# EAGLE schematic mmu6100cp (EAGLE 6.6.0)

## Sheet 1 of 3
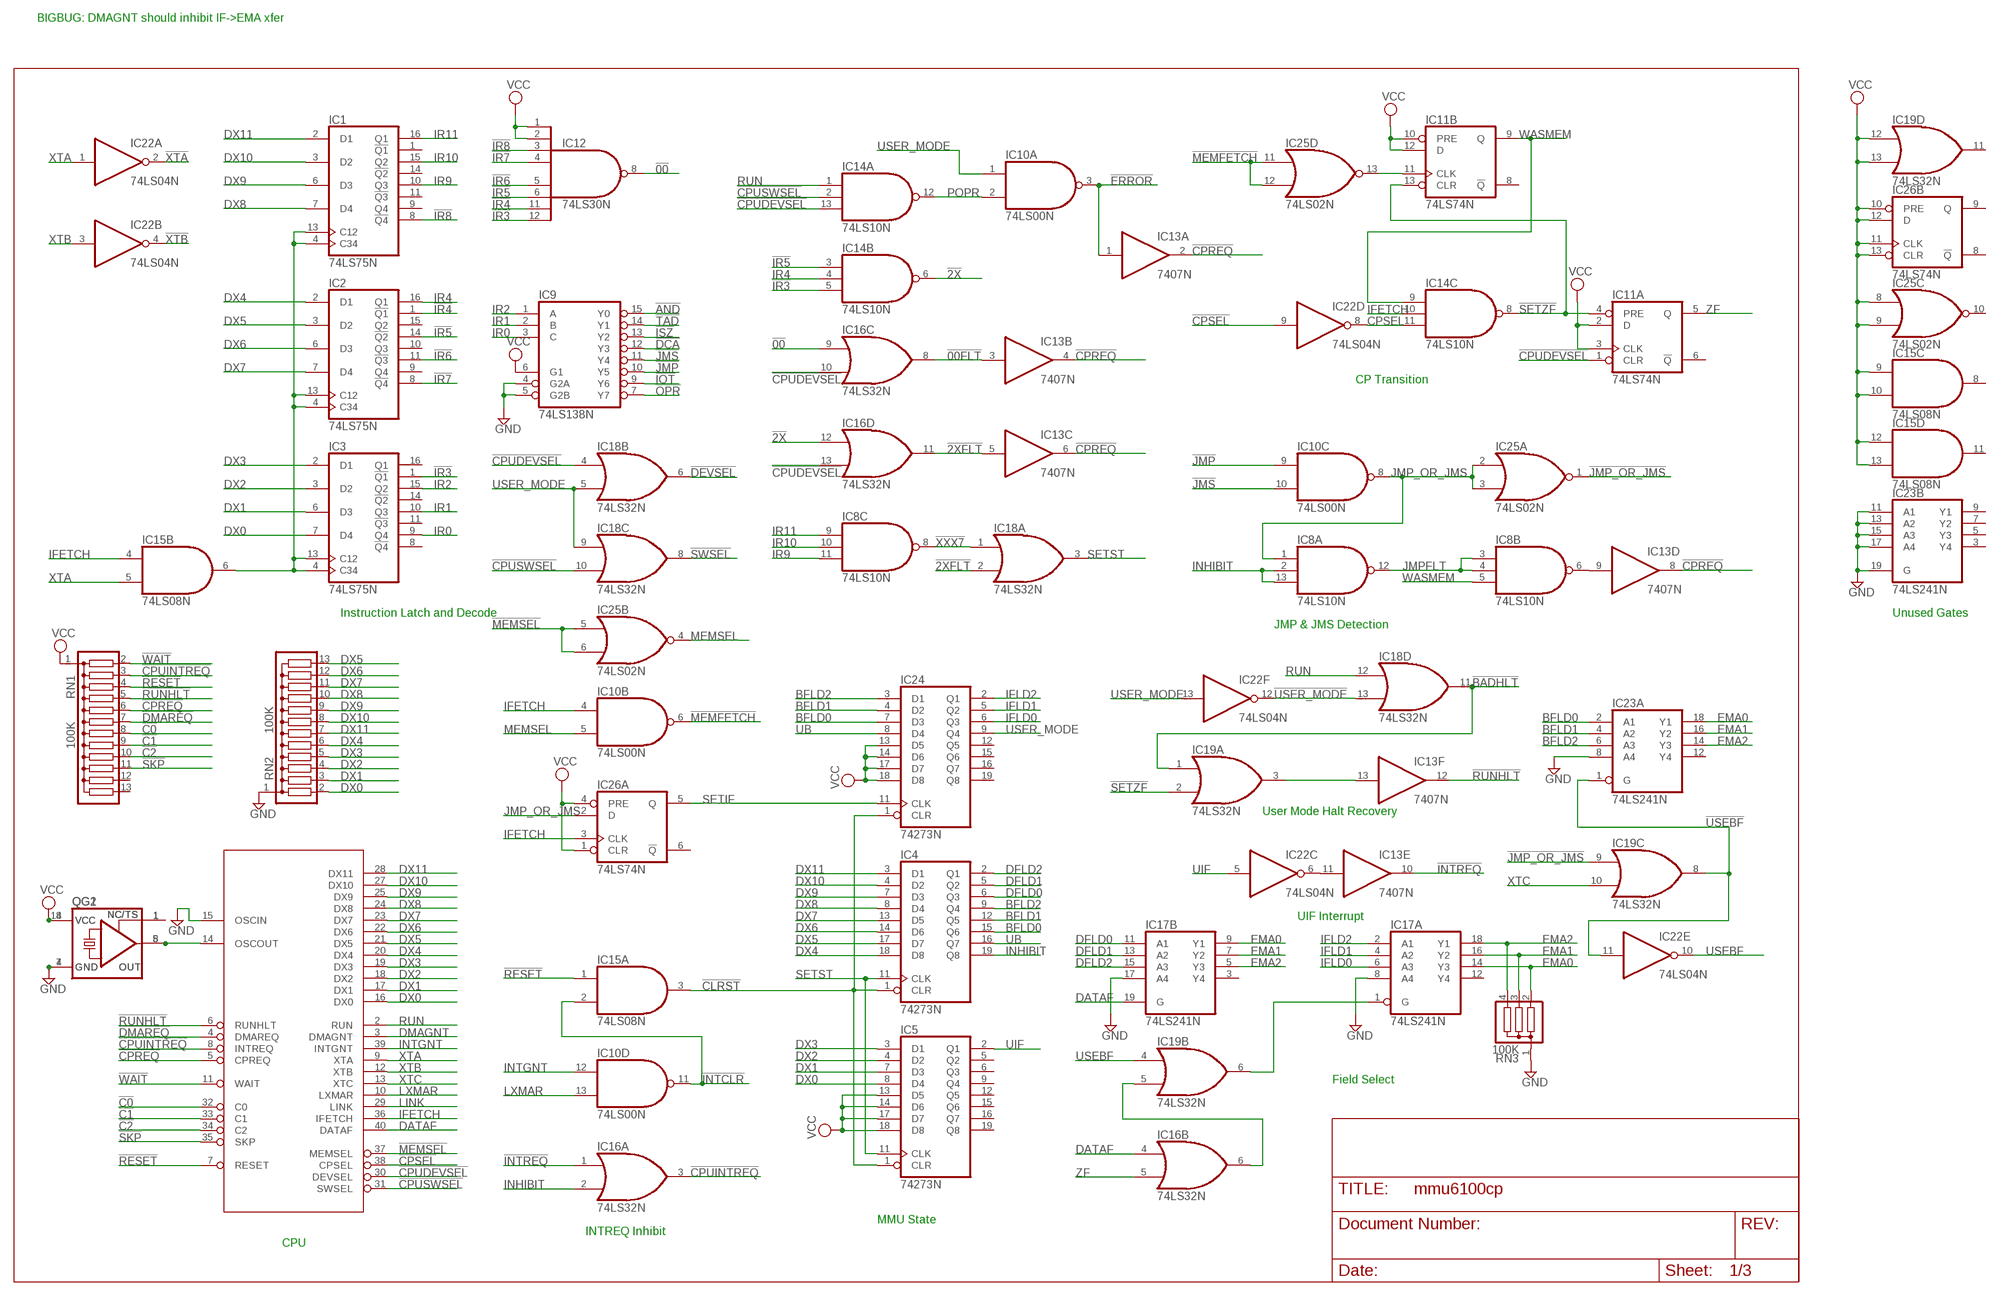
[diagram p0: schematic, sheet 1]

### Parts
CPU  IM6100  [DIL40]
IC1  74LS75N  [DIL16]
IC2  74LS75N  [DIL16]
IC3  74LS75N  [DIL16]
IC4  74273N  [DIL20]
IC5  74273N  [DIL20]
IC8  74LS10N  [DIL14]
IC9  74LS138N  [DIL16]
IC10  74LS00N  [DIL14]
IC11  74LS74N  [DIL14]
IC12  74LS30N  [DIL14]
IC13  7407N  [DIL14]
IC14  74LS10N  [DIL14]
IC15  74LS08N  [DIL14]
IC16  74LS32N  [DIL14]
IC17  74LS241N  [DIL20]
IC18  74LS32N  [DIL14]
IC19  74LS32N  [DIL14]
IC22  74LS04N  [DIL14]
IC23  74LS241N  [DIL20]
IC24  74273N  [DIL20]
IC25  74LS02N  [DIL14]
IC26  74LS74N  [DIL14]
QG1  XO-8  [DIL08S]
QG2  XO-14  [DIL14S]
RN1  100K  G12R  [SIL13]
RN2  100K  G12R  [SIL13]
RN3  100K  G03R  [SIL4]

### Nets
!00: IC12.8(O) IC16.9(C:I0)
!00FLT: IC13.3(B:I) IC16.8(C:O)
!2X: IC14.6(B:O) IC16.12(D:I0)
!2XFLT: IC13.5(C:I) IC16.11(D:O) IC18.2(A:I1)
!AND: IC9.15(Y0) ; also sheet 3
!BADHLT: IC18.11(D:O) IC19.1(A:I0)
!C0: CPU.32(C0) RN1.8 ; also sheet 3
!C1: CPU.33(C1) RN1.9 ; also sheet 3
!C2: CPU.34(C2) RN1.10 ; also sheet 3
!CLRST: IC4.1(CLR) IC5.1(CLR) IC15.3(A:O) IC24.1(CLR)
!CPREQ: CPU.5(CPREQ) IC13.2(A:O) IC13.4(B:O) IC13.6(C:O) IC13.8(D:O) RN1.6 ; also sheet 3
!CPSEL: CPU.38(CPSEL) IC22.9(D:I)
!CPUDEVSEL: CPU.30(DEVSEL) IC11.1(A:CLR) IC14.13(A:I2) IC16.10(C:I1) IC16.13(D:I1) IC18.4(B:I0)
!CPUINTREQ: CPU.8(INTREQ) IC16.3(A:O) RN1.3
!CPUSWSEL: CPU.31(SWSEL) IC14.2(A:I1) IC18.10(C:I1)
!DCA: IC9.12(Y3) ; also sheet 3
!DEVSEL: IC18.6(B:O) ; also sheet 3
!DMAREQ: CPU.4(DMAREQ) RN1.7 ; also sheet 3
!ERROR: IC10.3(A:O) IC13.1(A:I)
!INTCLR: IC10.11(D:O) IC15.2(A:I1)
!INTREQ: IC13.10(E:O) IC16.1(A:I0) ; also sheet 3
!IOT: IC9.9(Y6) ; also sheet 3
!IR3: IC3.1(!Q1) IC12.12(I7) IC14.5(B:I2)
!IR4: IC2.1(!Q1) IC12.11(I6)
!IR5: IC2.14(!Q2) IC12.6(I5) IC14.3(B:I0)
!IR6: IC2.11(!Q3) IC12.5(I4)
!IR7: IC2.8(!Q4) IC12.4(I3)
!IR8: IC1.8(!Q4) IC12.3(I2)
!ISZ: IC9.13(Y2) ; also sheet 3
!JMP: IC9.10(Y5) IC10.9(C:I0)
!JMP_OR_JMS: IC19.9(C:I0) IC25.1(A:O)
!JMS: IC9.11(Y4) IC10.10(C:I1)
!MEMFETCH: IC10.6(B:O) IC25.11(D:I0) IC25.12(D:I1)
!MEMSEL: CPU.37(MEMSEL) IC25.5(B:I0) IC25.6(B:I1) ; also sheet 3
!OPR: IC9.7(Y7) ; also sheet 3
!RESET: CPU.7(RESET) IC15.1(A:I0) RN1.4 ; also sheet 3
!RUNHLT: CPU.6(RUNHLT) IC13.12(F:O) RN1.5 ; also sheet 3
!SETZF: IC11.4(A:PRE) IC11.13(B:CLR) IC14.8(C:O) IC19.2(A:I1)
!SKP: CPU.35(SKP) RN1.11 ; also sheet 3
!SWSEL: IC18.8(C:O) ; also sheet 3
!TAD: IC9.14(Y1) ; also sheet 3
!USEBF: IC19.8(C:O) IC22.11(E:I) IC23.1(A:G)
!USER_MODE: IC18.13(D:I1) IC22.12(F:O)
!WAIT: CPU.11(WAIT) RN1.2 ; also sheet 3
!XTA: IC22.2(A:O)
!XTB: IC22.4(B:O)
!XXX7: IC8.8(C:O) IC18.1(A:I0)
BFLD0: IC4.15(Q6) IC23.2(A:A1) IC24.7(D3)
BFLD1: IC4.12(Q5) IC23.4(A:A2) IC24.4(D2)
BFLD2: IC4.9(Q4) IC23.6(A:A3) IC24.3(D1)
CPSEL: IC14.11(C:I2) IC22.8(D:O) ; also sheet 3
DATAF: CPU.40(DATAF) IC16.4(B:I0) IC17.19(B:G)
DFLD0: IC4.6(Q3) IC17.11(B:A1)
DFLD1: IC4.5(Q2) IC17.13(B:A2)
DFLD2: IC4.2(Q1) IC17.15(B:A3)
DMAGNT: CPU.3(DMAGNT) ; also sheet 3
DX0: CPU.16(DX0) IC3.7(D4) IC5.8(D4) RN2.2 ; also sheet 3
DX1: CPU.17(DX1) IC3.6(D3) IC5.7(D3) RN2.3 ; also sheet 3
DX2: CPU.18(DX2) IC3.3(D2) IC5.4(D2) RN2.4 ; also sheet 3
DX3: CPU.19(DX3) IC3.2(D1) IC5.3(D1) RN2.5 ; also sheet 3
DX4: CPU.20(DX4) IC2.2(D1) IC4.18(D8) RN2.6 ; also sheet 3
DX5: CPU.21(DX5) IC2.3(D2) IC4.17(D7) RN2.13 ; also sheet 3
DX6: CPU.22(DX6) IC2.6(D3) IC4.14(D6) RN2.12 ; also sheet 3
DX7: CPU.23(DX7) IC2.7(D4) IC4.13(D5) RN2.11 ; also sheet 3
DX8: CPU.24(DX8) IC1.7(D4) IC4.8(D4) RN2.10 ; also sheet 3
DX9: CPU.25(DX9) IC1.6(D3) IC4.7(D3) RN2.9 ; also sheet 3
DX10: CPU.27(DX10) IC1.3(D2) IC4.4(D2) RN2.8 ; also sheet 3
DX11: CPU.28(DX11) IC1.2(D1) IC4.3(D1) RN2.7 ; also sheet 3
EMA0: IC17.9(B:Y1) IC17.14(A:Y3) IC23.18(A:Y1) RN3.2 ; also sheet 3
EMA1: IC17.7(B:Y2) IC17.16(A:Y2) IC23.16(A:Y2) RN3.3 ; also sheet 3
EMA2: IC17.5(B:Y3) IC17.18(A:Y1) IC23.14(A:Y3) RN3.4 ; also sheet 3
GND: CPU.15(OSCIN) IC9.4(G2A) IC9.5(G2B) IC17.8(A:A4) IC17.17(B:A4) IC23.8(A:A4) IC23.11(B:A1) IC23.13(B:A2) IC23.15(B:A3) IC23.17(B:A4) IC23.19(B:G) QG1.4(GND) QG2.7(GND) RN2.1 RN3.1 ; also sheet 3
IFETCH: CPU.36(IFETCH) IC10.4(B:I0) IC14.10(C:I1) IC15.4(B:I0) IC26.3(A:CLK)
IFLD0: IC17.6(A:A3) IC24.6(Q3)
IFLD1: IC17.4(A:A2) IC24.5(Q2)
IFLD2: IC17.2(A:A1) IC24.2(Q1)
INHIBIT: IC4.19(Q8) IC8.2(A:I1) IC8.13(A:I2) IC16.2(A:I1)
INTGNT: CPU.39(INTGNT) IC10.12(D:I0) ; also sheet 3
IR0: IC3.9(Q4) IC9.3(C)
IR1: IC3.10(Q3) IC9.2(B)
IR2: IC3.15(Q2) IC9.1(A)
IR4: IC2.16(Q1) IC14.4(B:I1)
IR9: IC1.10(Q3) IC8.11(C:I2)
IR10: IC1.15(Q2) IC8.10(C:I1)
IR11: IC1.16(Q1) IC8.9(C:I0)
JMP_OR_JMS: IC8.1(A:I0) IC10.8(C:O) IC25.2(A:I0) IC25.3(A:I1) IC26.2(A:D)
JMPFLT: IC8.3(B:I0) IC8.4(B:I1) IC8.12(A:O)
LINK: CPU.29(LINK) ; also sheet 3
LXMAR: CPU.10(LXMAR) IC10.13(D:I1) ; also sheet 3
MEMSEL: IC10.5(B:I1) IC25.4(B:O) ; also sheet 3
N$2: QG1.1(TS) QG2.1(TS)
N$3: IC1.4(C34) IC1.13(C12) IC2.4(C34) IC2.13(C12) IC3.4(C34) IC3.13(C12) IC15.6(B:O)
N$5: IC13.11(E:I) IC22.6(C:O)
N$6: IC11.11(B:CLK) IC25.13(D:O)
N$7: IC13.13(F:I) IC19.3(A:O)
N$8: IC16.6(B:O) IC19.5(B:I1)
N$10: IC17.1(A:G) IC19.6(B:O)
N$15: IC8.6(B:O) IC13.9(D:I)
OSCOUT: CPU.14(OSCOUT) QG1.5(OUT) QG2.8(OUT)
POPR: IC10.2(A:I1) IC14.12(A:O)
RUN: CPU.2(RUN) IC14.1(A:I0) IC18.12(D:I0)
SETIF: IC24.11(CLK) IC26.5(A:Q)
SETST: IC4.11(CLK) IC5.11(CLK) IC18.3(A:O)
UB: IC4.16(Q7) IC24.8(D4)
UIF: IC5.2(Q1) IC22.5(C:I)
USEBF: IC19.4(B:I0) IC22.10(E:O)
USER_MODE: IC10.1(A:I0) IC18.5(B:I1) IC18.9(C:I0) IC22.13(F:I) IC24.9(Q4)
VCC: IC5.13(D5) IC5.14(D6) IC5.17(D7) IC5.18(D8) IC9.6(G1) IC11.2(A:D) IC11.3(A:CLK) IC11.10(B:PRE) IC11.12(B:D) IC12.1(I0) IC12.2(I1) IC15.9(C:I0) IC15.10(C:I1) IC15.12(D:I0) IC15.13(D:I1) IC19.12(D:I0) IC19.13(D:I1) IC24.13(D5) IC24.14(D6) IC24.17(D7) IC24.18(D8) IC25.8(C:I0) IC25.9(C:I1) IC26.1(A:CLR) IC26.4(A:PRE) IC26.10(B:PRE) IC26.11(B:CLK) IC26.12(B:D) IC26.13(B:CLR) QG1.8(VCC) QG2.14(VCC) RN1.1 ; also sheet 3
WASMEM: IC8.5(B:I2) IC11.9(B:Q) IC14.9(C:I0)
XTA: CPU.9(XTA) IC15.5(B:I1) IC22.1(A:I) ; also sheet 3
XTB: CPU.12(XTB) IC22.3(B:I) ; also sheet 3
XTC: CPU.13(XTC) IC19.10(C:I1) ; also sheet 3
ZF: IC11.5(A:Q) IC16.5(B:I1)
Unconnected: IC1.1(!Q1) IC1.9(Q4) IC1.11(!Q3) IC1.14(!Q2) IC2.9(Q4) IC2.10(Q3) IC2.15(Q2) IC3.8(!Q4) IC3.11(!Q3) IC3.14(!Q2) IC3.16(Q1) IC5.5(Q2) IC5.6(Q3) IC5.9(Q4) IC5.12(Q5) IC5.15(Q6) IC5.16(Q7) IC5.19(Q8) IC11.6(A:!Q) IC11.8(B:!Q) IC15.8(C:O) IC15.11(D:O) IC17.3(B:Y4) IC17.12(A:Y4) IC19.11(D:O) IC23.3(B:Y4) IC23.5(B:Y3) IC23.7(B:Y2) IC23.9(B:Y1) IC23.12(A:Y4) IC24.12(Q5) IC24.15(Q6) IC24.16(Q7) IC24.19(Q8) IC25.10(C:O) IC26.6(A:!Q) IC26.8(B:!Q) IC26.9(B:Q) RN1.12 RN1.13

### Notes on the sheet
- BIGBUG: DMAGNT should inhibit IF->EMA xfer
- CP Transition
- Instruction Latch and Decode | Unused Gates
- JMP & JMS Detection
- User Mode Halt Recovery
- UIF Interrupt
- Field Select
- MMU State
- INTREQ Inhibit
- CPU

## Sheet 2 of 3
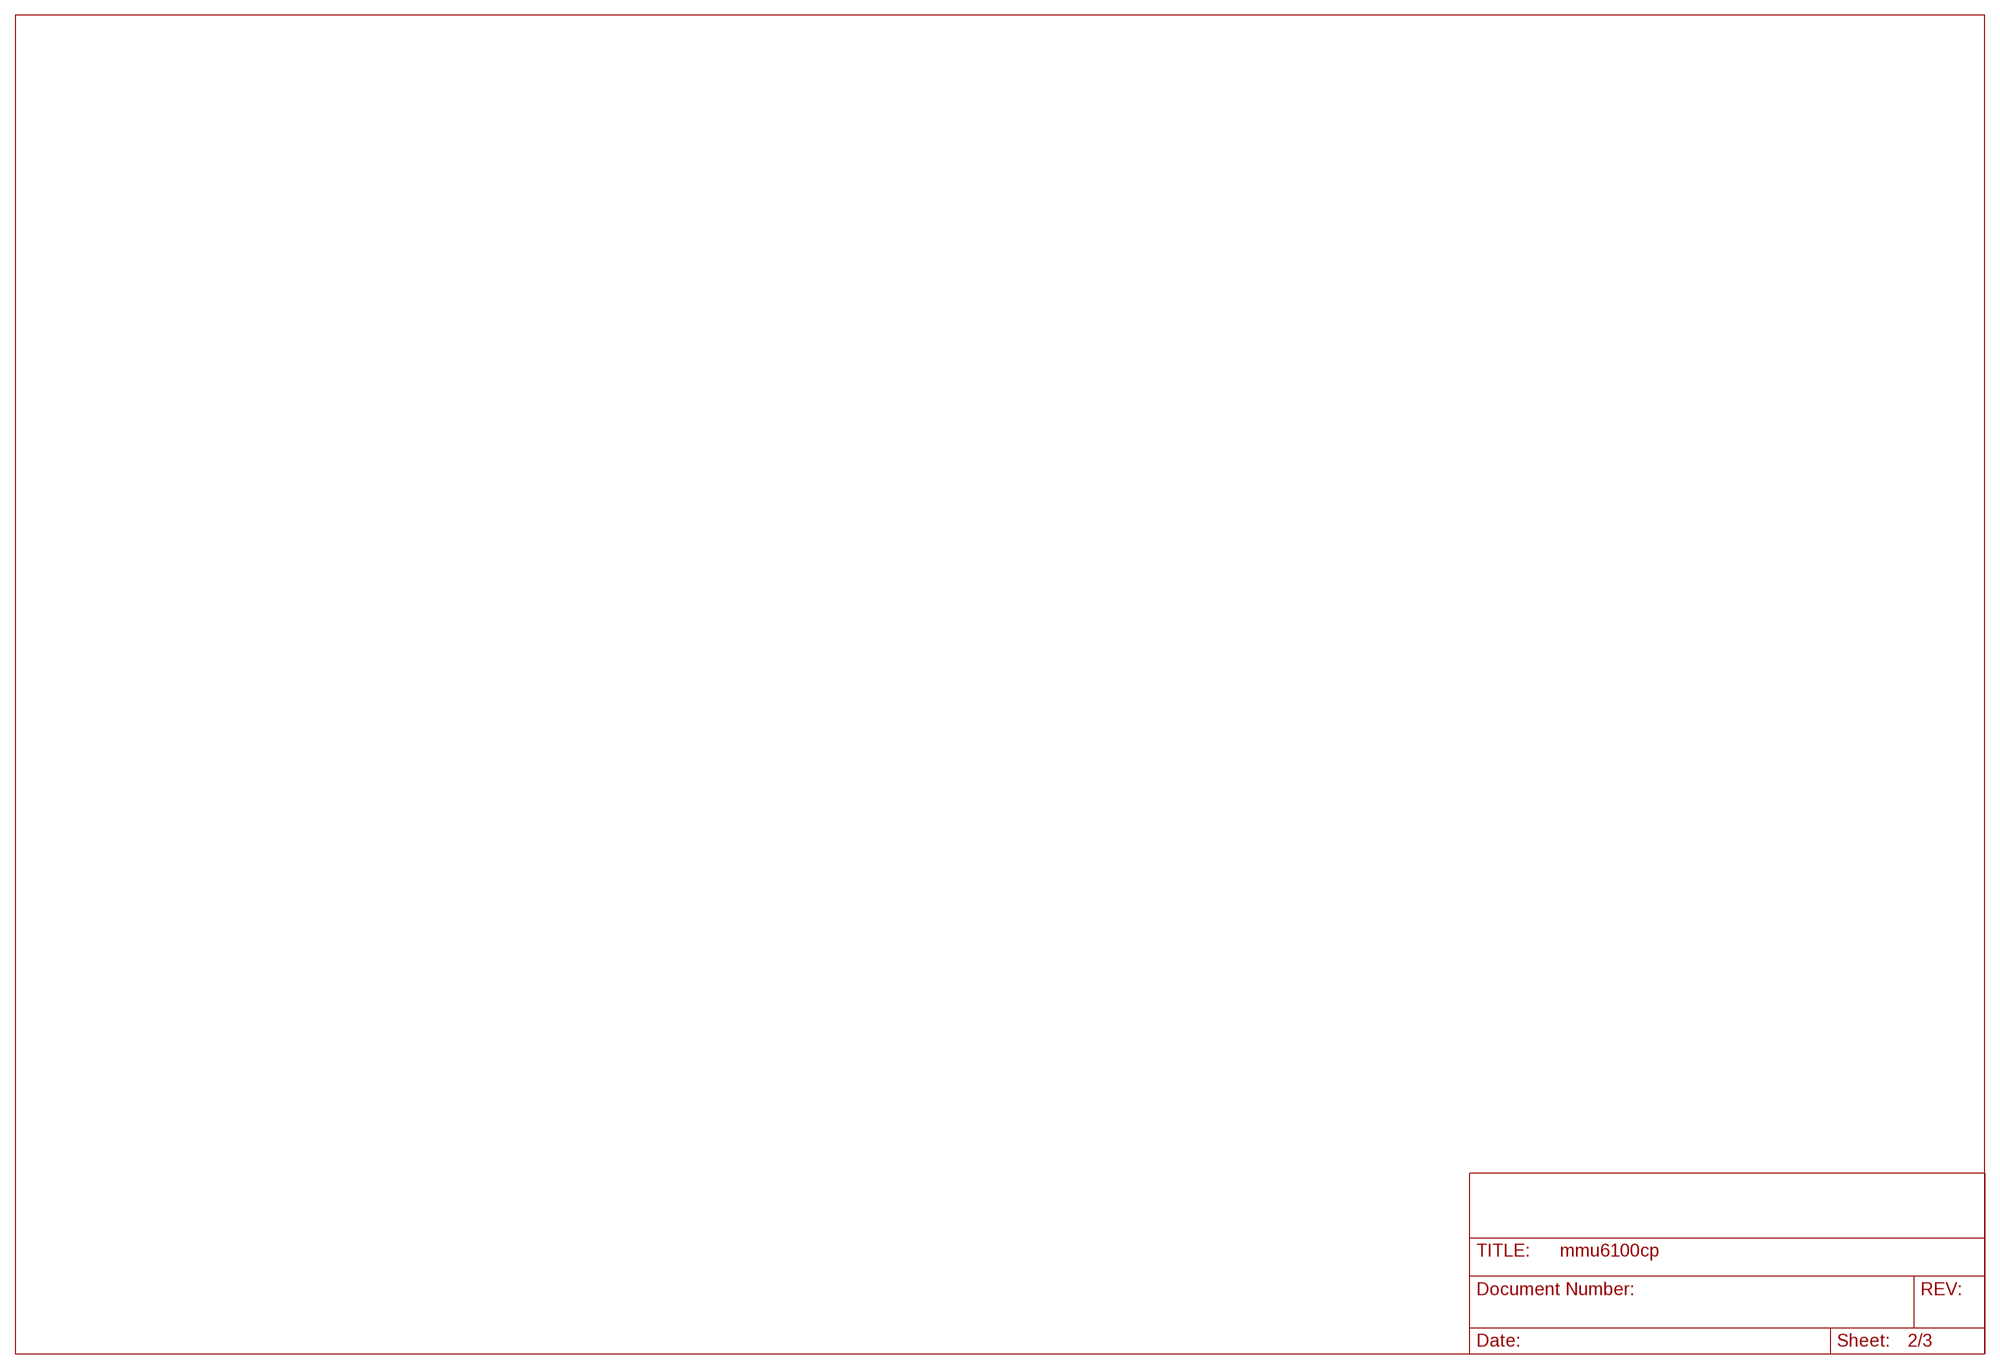
[diagram p1: schematic, sheet 2]

## Sheet 3 of 3
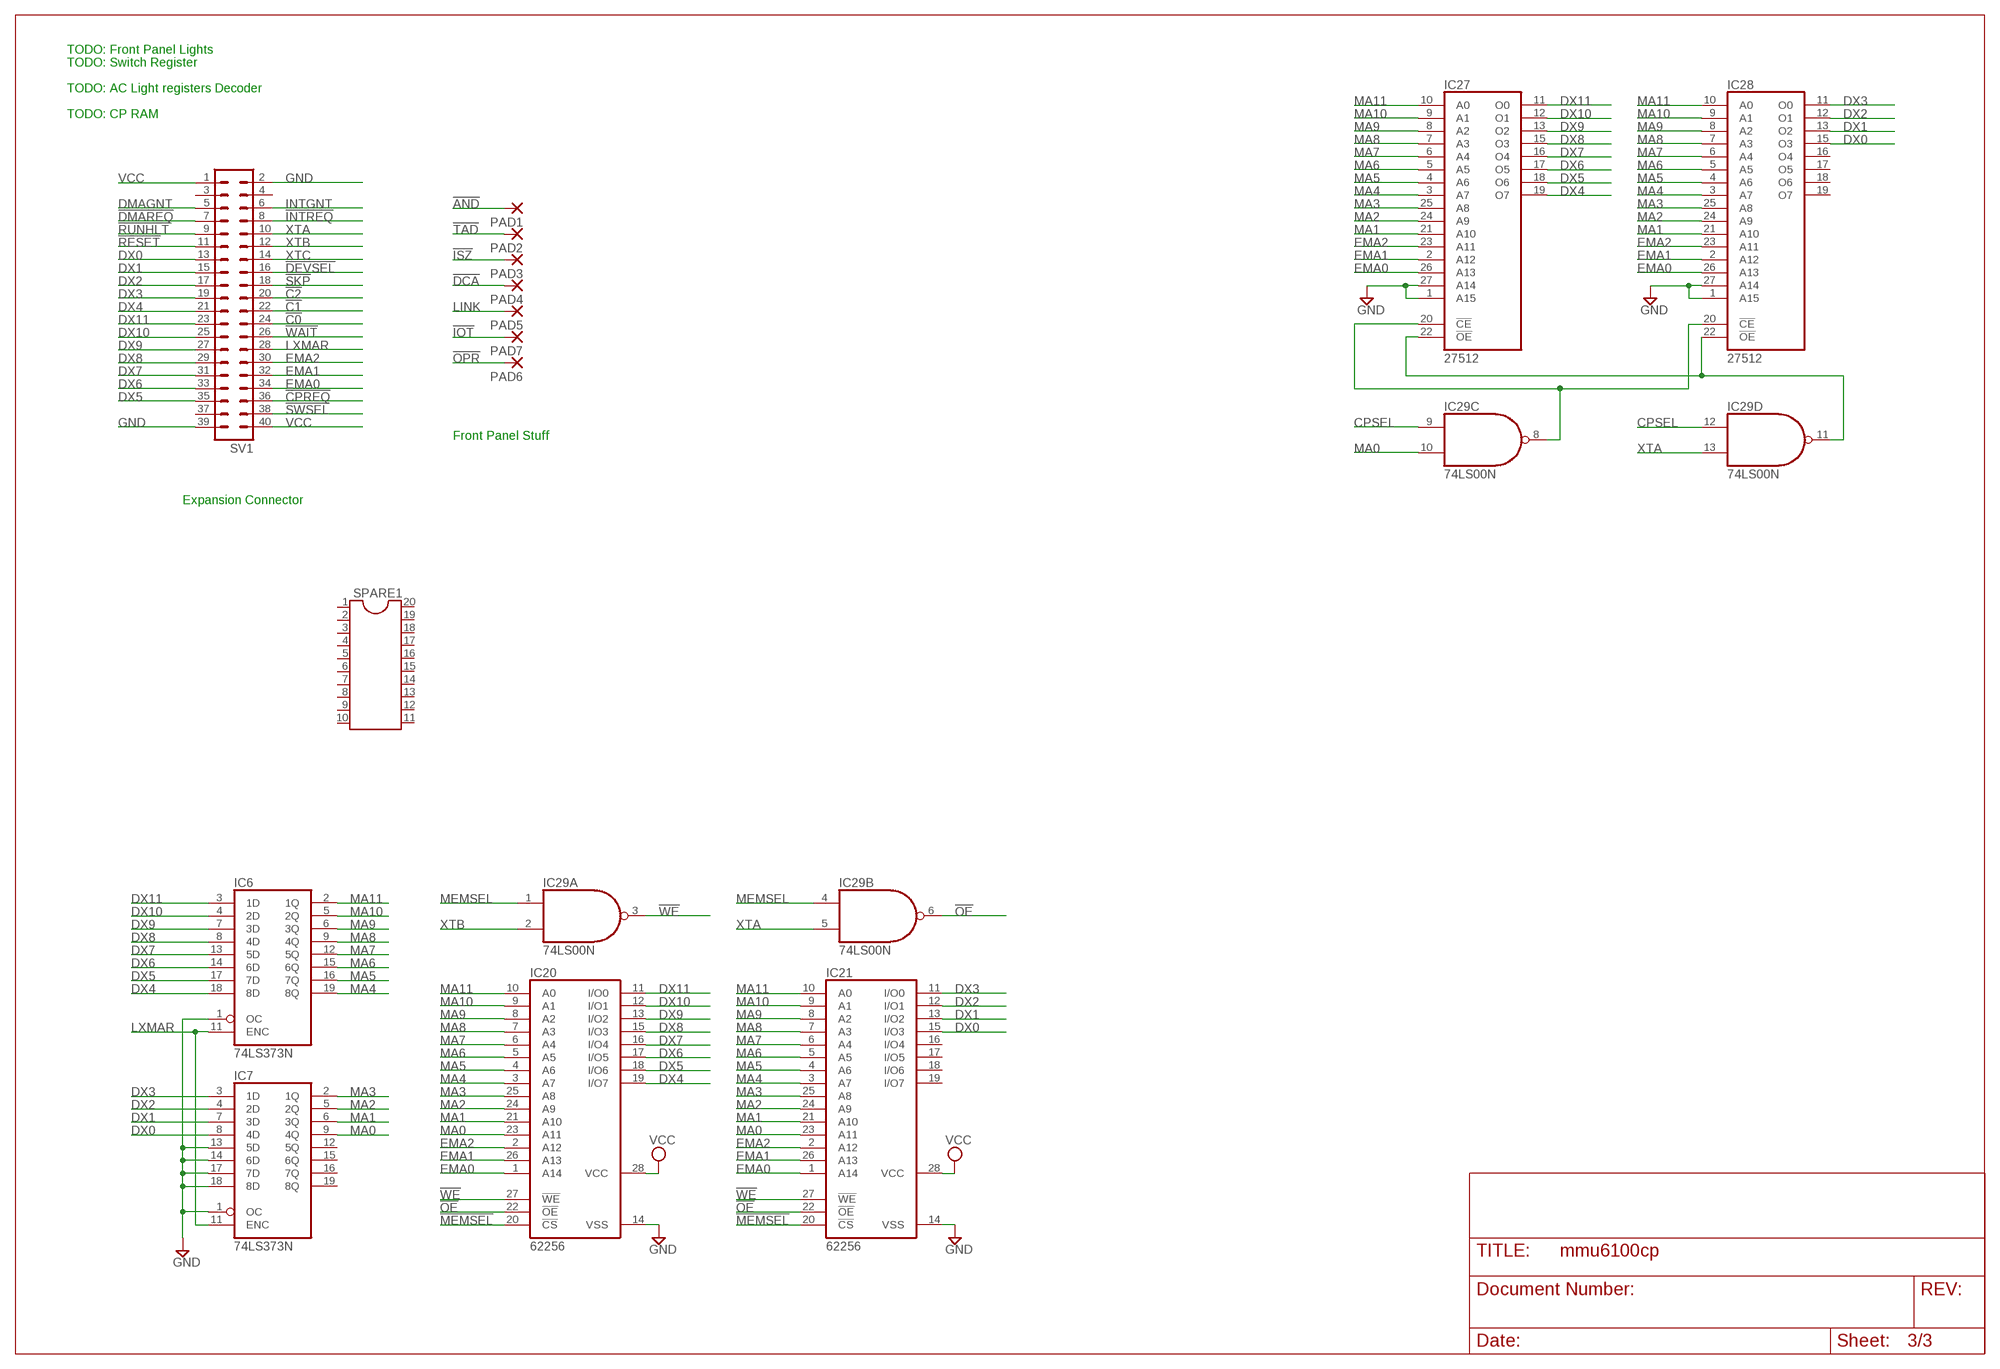
[diagram p2: schematic, sheet 3]

### Parts
IC6  74LS373N  [DIL20]
IC7  74LS373N  [DIL20]
IC20  62256  62256P  [DIL28-6]
IC21  62256  62256P  [DIL28-6]
IC27  27512  [DIL28]
IC28  27512  [DIL28]
IC29  74LS00N  [DIL14]
PAD1  2,15/1,0  [2,15/1,0]
PAD2  2,15/1,0  [2,15/1,0]
PAD3  2,15/1,0  [2,15/1,0]
PAD4  2,15/1,0  [2,15/1,0]
PAD5  2,15/1,0  [2,15/1,0]
PAD6  2,15/1,0  [2,15/1,0]
PAD7  2,15/1,0  [2,15/1,0]
SPARE1  DIL20  [DIL20]
SV1  MA20-2  [MA20-2]

### Nets
!AND: PAD1.1(P) ; also sheet 1
!C0: SV1.24 ; also sheet 1
!C1: SV1.22 ; also sheet 1
!C2: SV1.20 ; also sheet 1
!CPREQ: SV1.36 ; also sheet 1
!DCA: PAD4.1(P) ; also sheet 1
!DEVSEL: SV1.16 ; also sheet 1
!DMAREQ: SV1.7 ; also sheet 1
!INTREQ: SV1.8 ; also sheet 1
!IOT: PAD7.1(P) ; also sheet 1
!ISZ: PAD3.1(P) ; also sheet 1
!MEMSEL: IC20.20(!CS) IC21.20(!CS) ; also sheet 1
!OE: IC20.22(!OE) IC21.22(!OE) IC29.6(B:O)
!OPR: PAD6.1(P) ; also sheet 1
!RESET: SV1.11 ; also sheet 1
!RUNHLT: SV1.9 ; also sheet 1
!SKP: SV1.18 ; also sheet 1
!SWSEL: SV1.38 ; also sheet 1
!TAD: PAD2.1(P) ; also sheet 1
!WAIT: SV1.26 ; also sheet 1
!WE: IC20.27(!WE) IC21.27(!WE) IC29.3(A:O)
CPSEL: IC29.9(C:I0) IC29.12(D:I0) ; also sheet 1
DMAGNT: SV1.5 ; also sheet 1
DX0: IC7.8(4D) IC21.15(I/O3) IC28.15(O3) SV1.13 ; also sheet 1
DX1: IC7.7(3D) IC21.13(I/O2) IC28.13(O2) SV1.15 ; also sheet 1
DX2: IC7.4(2D) IC21.12(I/O1) IC28.12(O1) SV1.17 ; also sheet 1
DX3: IC7.3(1D) IC21.11(I/O0) IC28.11(O0) SV1.19 ; also sheet 1
DX4: IC6.18(8D) IC20.19(I/O7) IC27.19(O7) SV1.21 ; also sheet 1
DX5: IC6.17(7D) IC20.18(I/O6) IC27.18(O6) SV1.35 ; also sheet 1
DX6: IC6.14(6D) IC20.17(I/O5) IC27.17(O5) SV1.33 ; also sheet 1
DX7: IC6.13(5D) IC20.16(I/O4) IC27.16(O4) SV1.31 ; also sheet 1
DX8: IC6.8(4D) IC20.15(I/O3) IC27.15(O3) SV1.29 ; also sheet 1
DX9: IC6.7(3D) IC20.13(I/O2) IC27.13(O2) SV1.27 ; also sheet 1
DX10: IC6.4(2D) IC20.12(I/O1) IC27.12(O1) SV1.25 ; also sheet 1
DX11: IC6.3(1D) IC20.11(I/O0) IC27.11(O0) SV1.23 ; also sheet 1
EMA0: IC20.1(A14) IC21.1(A14) IC27.26(A13) IC28.26(A13) SV1.34 ; also sheet 1
EMA1: IC20.26(A13) IC21.26(A13) IC27.2(A12) IC28.2(A12) SV1.32 ; also sheet 1
EMA2: IC20.2(A12) IC21.2(A12) IC27.23(A11) IC28.23(A11) SV1.30 ; also sheet 1
GND: IC6.1(OC) IC7.1(OC) IC7.13(5D) IC7.14(6D) IC7.17(7D) IC7.18(8D) IC20.14(VSS) IC21.14(VSS) IC27.1(A15) IC27.27(A14) IC28.1(A15) IC28.27(A14) SV1.2 SV1.39 ; also sheet 1
INTGNT: SV1.6 ; also sheet 1
LINK: PAD5.1(P) ; also sheet 1
LXMAR: IC6.11(ENC) IC7.11(ENC) SV1.28 ; also sheet 1
MA0: IC7.9(4Q) IC20.23(A11) IC21.23(A11) IC29.10(C:I1)
MA1: IC7.6(3Q) IC20.21(A10) IC21.21(A10) IC27.21(A10) IC28.21(A10)
MA2: IC7.5(2Q) IC20.24(A9) IC21.24(A9) IC27.24(A9) IC28.24(A9)
MA3: IC7.2(1Q) IC20.25(A8) IC21.25(A8) IC27.25(A8) IC28.25(A8)
MA4: IC6.19(8Q) IC20.3(A7) IC21.3(A7) IC27.3(A7) IC28.3(A7)
MA5: IC6.16(7Q) IC20.4(A6) IC21.4(A6) IC27.4(A6) IC28.4(A6)
MA6: IC6.15(6Q) IC20.5(A5) IC21.5(A5) IC27.5(A5) IC28.5(A5)
MA7: IC6.12(5Q) IC20.6(A4) IC21.6(A4) IC27.6(A4) IC28.6(A4)
MA8: IC6.9(4Q) IC20.7(A3) IC21.7(A3) IC27.7(A3) IC28.7(A3)
MA9: IC6.6(3Q) IC20.8(A2) IC21.8(A2) IC27.8(A2) IC28.8(A2)
MA10: IC6.5(2Q) IC20.9(A1) IC21.9(A1) IC27.9(A1) IC28.9(A1)
MA11: IC6.2(1Q) IC20.10(A0) IC21.10(A0) IC27.10(A0) IC28.10(A0)
MEMSEL: IC29.1(A:I0) IC29.4(B:I0) ; also sheet 1
N$9: IC27.20(!CE) IC28.20(!CE) IC29.8(C:O)
N$11: IC27.22(!OE) IC28.22(!OE) IC29.11(D:O)
VCC: IC20.28(VCC) IC21.28(VCC) SV1.1 SV1.40 ; also sheet 1
XTA: IC29.5(B:I1) IC29.13(D:I1) SV1.10 ; also sheet 1
XTB: IC29.2(A:I1) SV1.12 ; also sheet 1
XTC: SV1.14 ; also sheet 1
Unconnected: IC7.12(5Q) IC7.15(6Q) IC7.16(7Q) IC7.19(8Q) IC21.16(I/O4) IC21.17(I/O5) IC21.18(I/O6) IC21.19(I/O7) IC28.16(O4) IC28.17(O5) IC28.18(O6) IC28.19(O7) SPARE1.1 SPARE1.2 SPARE1.3 SPARE1.4 SPARE1.5 SPARE1.6 SPARE1.7 SPARE1.8 SPARE1.9 SPARE1.10 SPARE1.11 SPARE1.12 SPARE1.13 SPARE1.14 SPARE1.15 SPARE1.16 SPARE1.17 SPARE1.18 SPARE1.19 SPARE1.20 SV1.3 SV1.4 SV1.37

### Notes on the sheet
- TODO: Front Panel Lights
- TODO: Switch Register
- TODO: AC Light registers Decoder
- TODO: CP RAM
- Front Panel Stuff
- Expansion Connector

## Power pins joined to a net without a drawn wire
GND: CPU.26(GND) IC1.12(GND) IC2.12(GND) IC3.12(GND) IC4.10(GND) IC5.10(GND) IC6.10(GND) IC7.10(GND) IC8.7(P:GND) IC9.8(GND) IC10.7(P:GND) IC11.7(P:GND) IC12.7(GND) IC13.7(P:GND) IC14.7(P:GND) IC15.7(P:GND) IC16.7(P:GND) IC17.10(P:GND) IC18.7(P:GND) IC19.7(P:GND) IC22.7(P:GND) IC23.10(P:GND) IC24.10(GND) IC25.7(P:GND) IC26.7(P:GND) IC27.14(GND) IC28.14(GND) IC29.7(P:GND)
VCC: CPU.1(VCC) IC1.5(VCC) IC2.5(VCC) IC3.5(VCC) IC4.20(VCC) IC5.20(VCC) IC6.20(VCC) IC7.20(VCC) IC8.14(P:VCC) IC9.16(VCC) IC10.14(P:VCC) IC11.14(P:VCC) IC12.14(VCC) IC13.14(P:VCC) IC14.14(P:VCC) IC15.14(P:VCC) IC16.14(P:VCC) IC17.20(P:VCC) IC18.14(P:VCC) IC19.14(P:VCC) IC22.14(P:VCC) IC23.20(P:VCC) IC24.20(VCC) IC25.14(P:VCC) IC26.14(P:VCC) IC27.28(VCC) IC28.28(VCC) IC29.14(P:VCC)

## Library data of the parts
CPU = dec-con:IM6100: IM6100 PDP-8 on a chip.
IC1-IC3 = 74xx-us:74*75: 4-bit bistable LATCH
IC4 IC5 IC24 = 74xx-us:74*273: Octal D type FLIP FLOP, clear
IC6 IC7 = 74xx-us:74*373: Octal D type transparent LATCH, edge triggered
IC8 IC14 = 74xx-us:74*10: Triple 3-input NAND gate
IC9 = 74xx-us:74*138: 3-line to 8-line DECODER/DEMULTIPLEXER
IC10 IC29 = 74xx-us:74*00: Quad 2-input NAND gate
IC11 IC26 = 74xx-us:74*74: Dual D type positive edge triggered FLIP FLOP, preset and clear
IC12 = 74xx-us:74*30: 8-input NAND gate
IC13 = 74xx-us:74*07: Hex BUFFER, open collector high-voltage output
IC15 = 74xx-us:74*08: Quad 2-input AND gate
IC16 IC18 IC19 = 74xx-us:74*32: Quad 2-input OR gate
IC17 IC23 = 74xx-us:74*241: Octal BUFFER and LINE DRIVER, 3-state
IC20 IC21 = memory-hitachi:62256P: MEMORY; OC_FARNELL: unknown; OC_NEWARK: unknown
IC22 = 74xx-us:74*04: Hex INVERTER
IC25 = 74xx-us:74*02: Quad 2-input NOR gate
IC27 IC28 = memory:27512: MEMORY
PAD1-PAD7 = wirepad:2,15/1,0: THROUGH-HOLE PAD
QG1 QG2 = crystal:XO-: CRYSTAL; OC_FARNELL: unknown; OC_NEWARK: unknown
RN1 RN2 = resistor-sil:G12R: SIL RESISTOR; OC_FARNELL: unknown; OC_NEWARK: unknown
RN3 = resistor-sil:G03R: SIL RESISTOR; OC_FARNELL: unknown; OC_NEWARK: unknown
SPARE1 = ic-package:DIL20: Dual In Line / Socket
SV1 = con-lstb:MA20-2: PIN HEADER; OC_FARNELL: unknown; OC_NEWARK: unknown